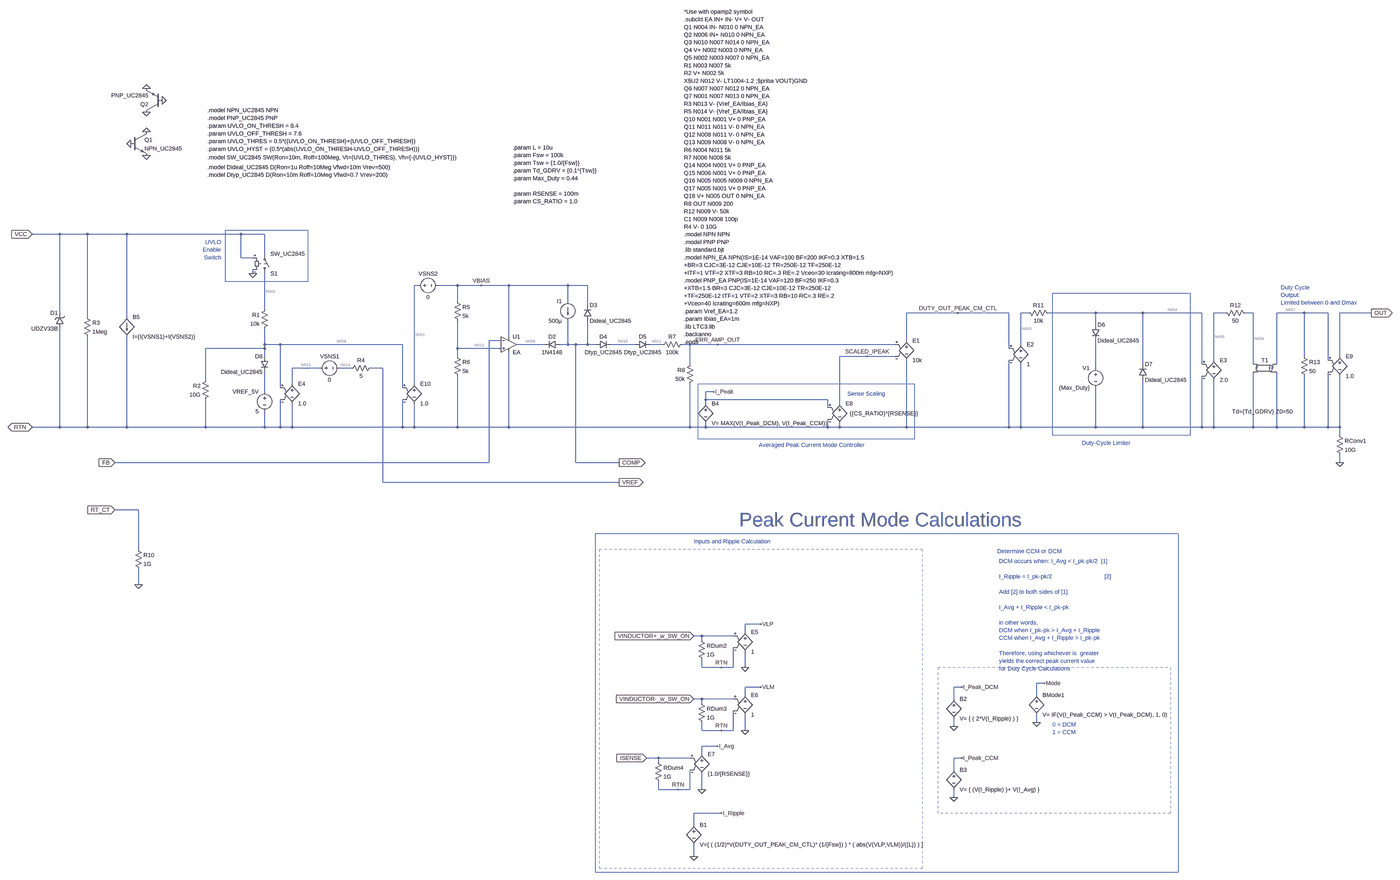
[diagram p0: schematic UC3845_AVG.asc, whole sheet]
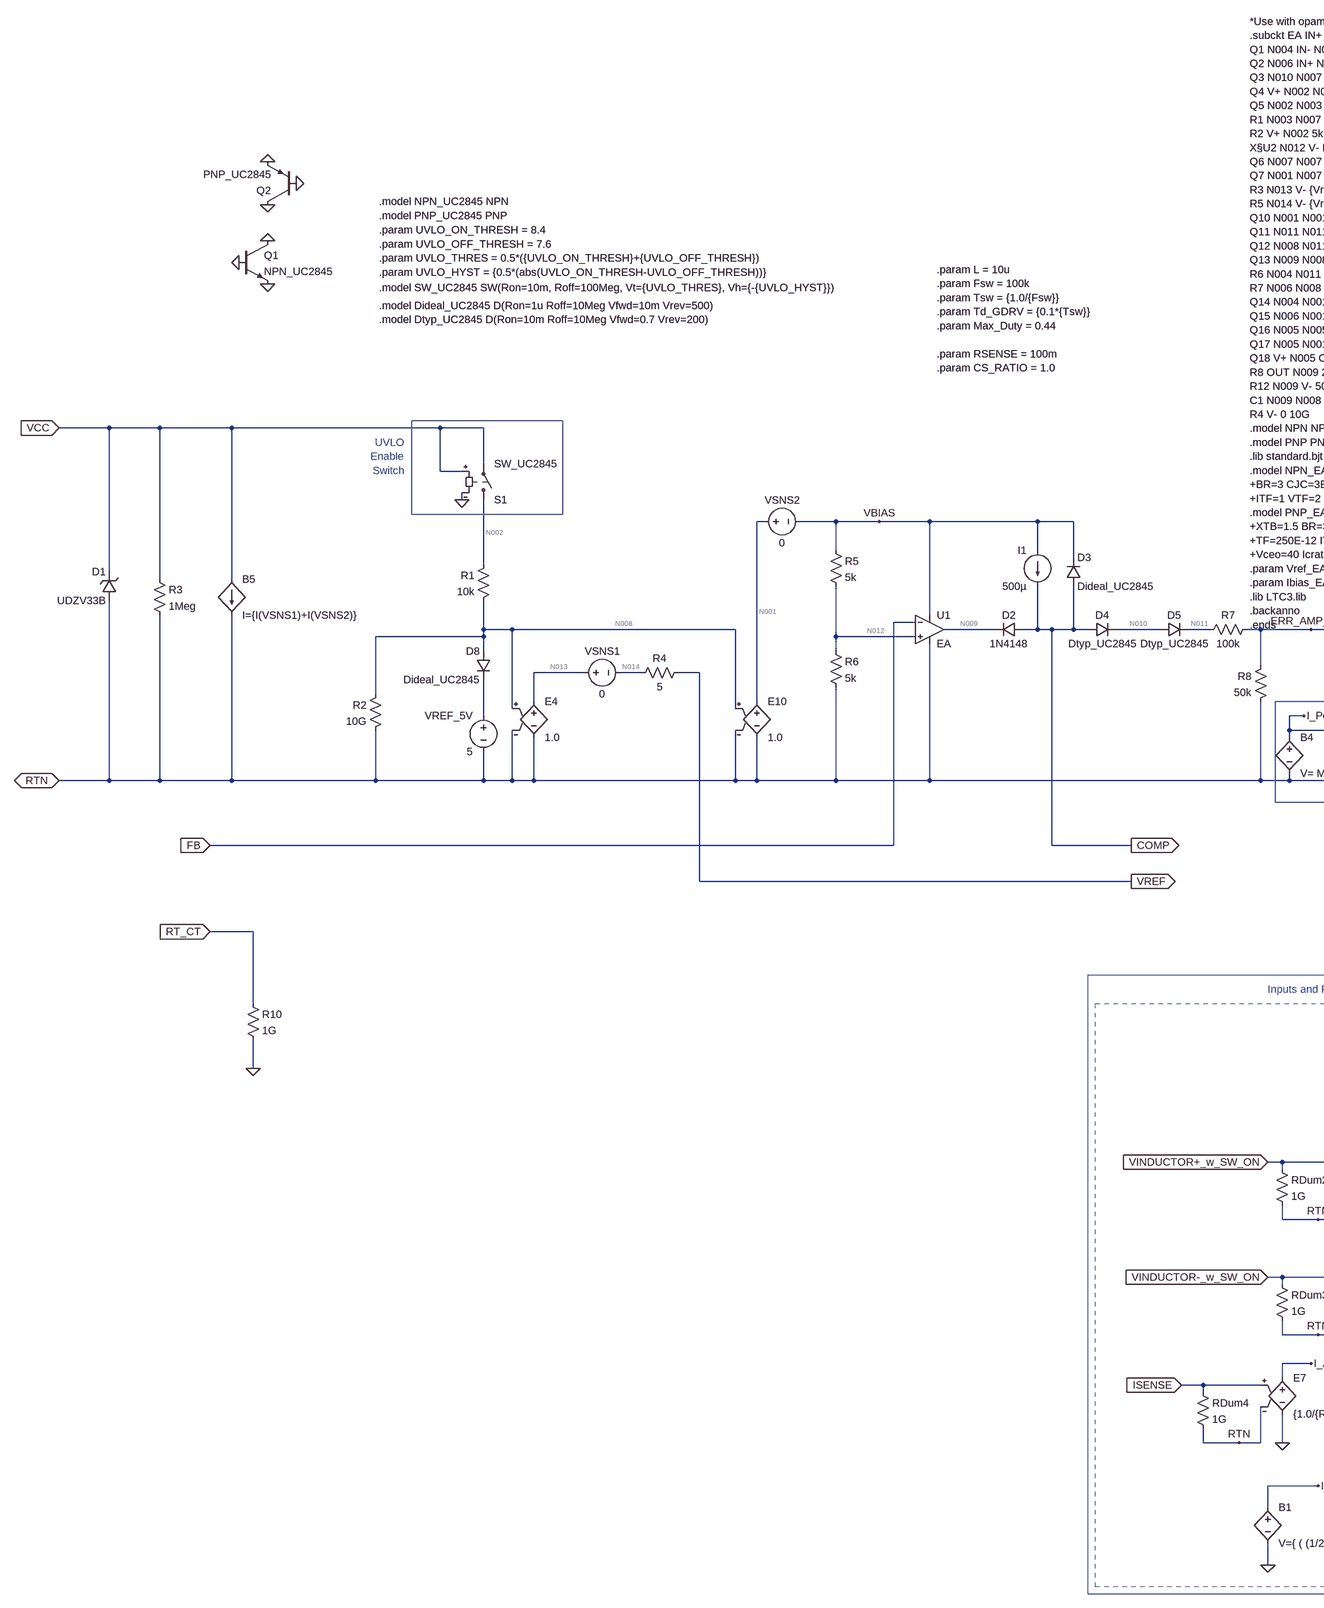
[diagram p1: schematic UC3845_AVG.asc, part, row 1 of 1, column 1 of 2]
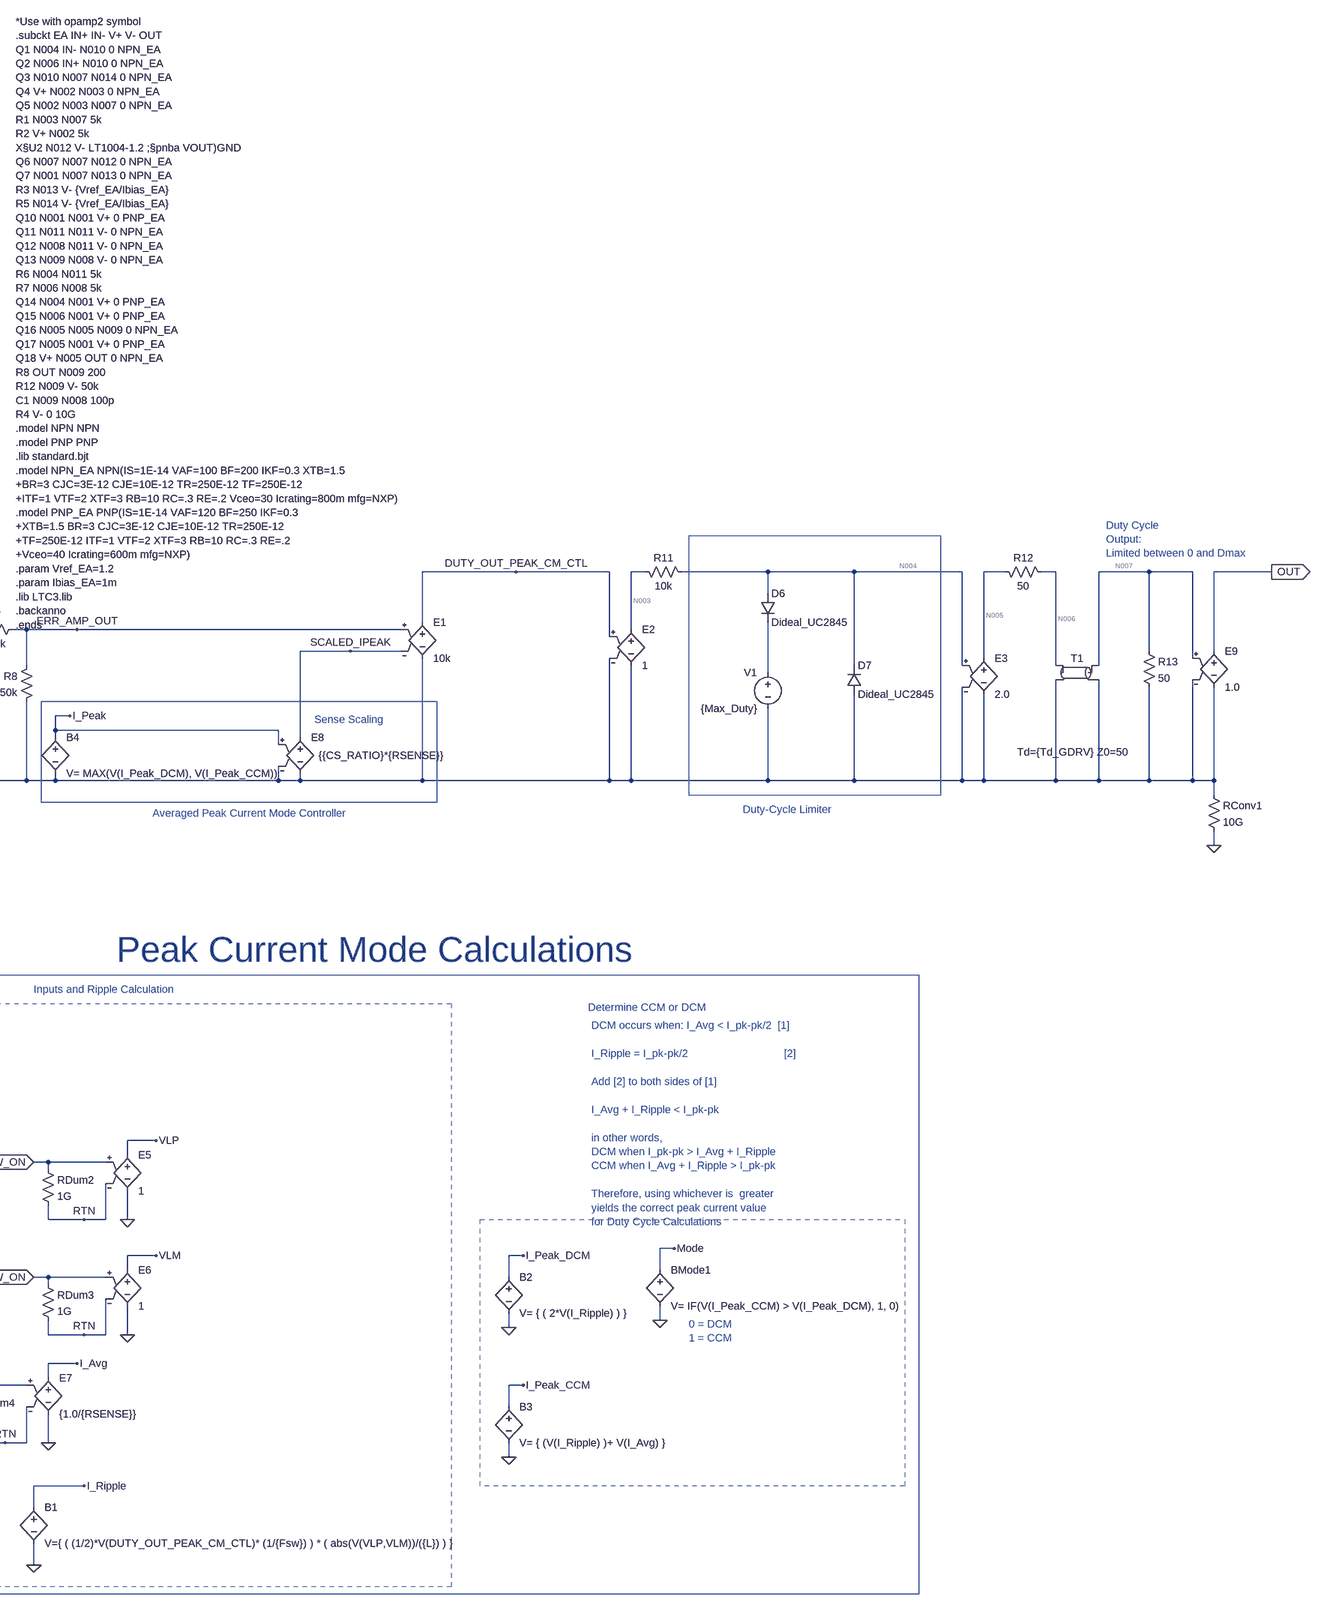
[diagram p2: schematic UC3845_AVG.asc, part, row 1 of 1, column 2 of 2]
UC3845_AVG.asc, the LTspice schematic file:
Version 4.1
SHEET 1 5444 3284
WIRE -736 -48 -848 -48
WIRE -624 -48 -736 -48
WIRE -464 -48 -624 -48
WIRE 0 -48 -464 -48
WIRE 96 -48 0 -48
WIRE 96 32 96 -48
WIRE 0 48 0 -48
WIRE 48 48 0 48
WIRE 48 112 48 96
WIRE 720 160 704 160
WIRE 880 160 800 160
WIRE 976 160 880 160
WIRE 1088 160 976 160
WIRE 1328 160 1088 160
WIRE 1408 160 1328 160
WIRE 880 224 880 160
WIRE 1328 224 1328 160
WIRE 1408 240 1408 160
WIRE 96 256 96 112
WIRE -736 272 -736 -48
WIRE 2912 272 2704 272
WIRE 3120 272 2912 272
WIRE 3200 272 3168 272
WIRE 3472 272 3280 272
WIRE 3664 272 3472 272
WIRE 3904 272 3664 272
WIRE 4000 272 3952 272
WIRE 4112 272 4080 272
WIRE 4320 272 4208 272
WIRE 4416 272 4320 272
WIRE 4592 272 4464 272
WIRE -624 288 -624 -48
WIRE -464 288 -464 -48
WIRE 3472 320 3472 272
WIRE 1088 368 1088 160
WIRE 1056 384 1008 384
WIRE 2704 384 2704 272
WIRE 96 400 96 336
WIRE 160 400 96 400
WIRE 656 400 160 400
WIRE 1232 400 1120 400
WIRE 1328 400 1328 304
WIRE 1328 400 1296 400
WIRE 1360 400 1328 400
WIRE 1408 400 1408 304
WIRE 1408 400 1360 400
WIRE 1440 400 1408 400
WIRE 1600 400 1504 400
WIRE 1712 400 1664 400
WIRE 1824 400 1792 400
WIRE 1936 400 1824 400
WIRE 2656 400 1936 400
WIRE 3168 400 3168 272
WIRE 96 416 96 400
WIRE 96 416 -144 416
WIRE 880 416 880 304
WIRE 1056 416 880 416
WIRE 3120 416 3120 272
WIRE 96 448 96 416
WIRE 880 448 880 416
WIRE 2544 448 2432 448
WIRE 2656 448 2544 448
WIRE 4320 448 4320 272
WIRE 4464 448 4464 272
WIRE 3952 464 3952 272
WIRE 4416 464 4416 272
WIRE 1824 480 1824 400
WIRE 3664 480 3664 272
WIRE 3904 480 3904 272
WIRE 4112 480 4112 272
WIRE 4208 480 4208 272
WIRE 320 496 208 496
WIRE 448 496 400 496
WIRE 576 496 528 496
WIRE 3472 496 3472 384
WIRE -144 544 -144 416
WIRE 208 560 208 496
WIRE 704 560 704 160
WIRE 160 576 160 400
WIRE 656 576 656 400
WIRE 96 592 96 512
WIRE 1920 592 1888 592
WIRE 1888 624 1888 592
WIRE 2384 624 1888 624
WIRE 1888 640 1888 624
WIRE 2432 640 2432 448
WIRE 2384 656 2384 624
WIRE -736 736 -736 336
WIRE -736 736 -848 736
WIRE -624 736 -624 368
WIRE -624 736 -736 736
WIRE -464 736 -464 368
WIRE -464 736 -624 736
WIRE -144 736 -144 624
WIRE -144 736 -464 736
WIRE 96 736 96 672
WIRE 96 736 -144 736
WIRE 160 736 160 624
WIRE 160 736 96 736
WIRE 208 736 208 640
WIRE 208 736 160 736
WIRE 656 736 656 624
WIRE 656 736 208 736
WIRE 704 736 704 640
WIRE 704 736 656 736
WIRE 880 736 880 528
WIRE 880 736 704 736
WIRE 1088 736 1088 432
WIRE 1088 736 880 736
WIRE 1824 736 1824 560
WIRE 1824 736 1088 736
WIRE 1888 736 1888 720
WIRE 1888 736 1824 736
WIRE 2384 736 2384 704
WIRE 2384 736 1888 736
WIRE 2432 736 2432 720
WIRE 2432 736 2384 736
WIRE 2704 736 2704 464
WIRE 2704 736 2432 736
WIRE 3120 736 3120 464
WIRE 3120 736 2704 736
WIRE 3168 736 3168 480
WIRE 3168 736 3120 736
WIRE 3472 736 3472 576
WIRE 3472 736 3168 736
WIRE 3664 736 3664 544
WIRE 3664 736 3472 736
WIRE 3904 736 3904 528
WIRE 3904 736 3664 736
WIRE 3952 736 3952 544
WIRE 3952 736 3904 736
WIRE 4112 736 4112 512
WIRE 4112 736 3952 736
WIRE 4208 736 4208 512
WIRE 4208 736 4112 736
WIRE 4320 736 4320 528
WIRE 4320 736 4208 736
WIRE 4416 736 4416 512
WIRE 4416 736 4320 736
WIRE 4464 736 4464 528
WIRE 4464 736 4416 736
WIRE 4464 768 4464 736
WIRE 1008 880 1008 384
WIRE 1008 880 -512 880
WIRE 1360 880 1360 400
WIRE 1536 880 1360 880
WIRE 4464 880 4464 848
WIRE 576 960 576 496
WIRE 1536 960 576 960
WIRE -416 1072 -512 1072
WIRE -416 1232 -416 1072
WIRE -416 1376 -416 1312
WIRE 2112 1536 2048 1536
WIRE 2048 1568 2048 1536
WIRE 1872 1584 1840 1584
WIRE 2000 1584 1872 1584
WIRE 1872 1600 1872 1584
WIRE 1872 1712 1872 1680
WIRE 1952 1712 1872 1712
WIRE 2000 1712 2000 1632
WIRE 2000 1712 1952 1712
WIRE 2048 1712 2048 1648
WIRE 3264 1776 3232 1776
WIRE 2112 1792 2048 1792
WIRE 2928 1792 2896 1792
WIRE 2048 1824 2048 1792
WIRE 3232 1824 3232 1776
WIRE 1872 1840 1840 1840
WIRE 2000 1840 1872 1840
WIRE 2896 1840 2896 1792
WIRE 1872 1856 1872 1840
WIRE 3232 1936 3232 1904
WIRE 2896 1952 2896 1920
WIRE 1872 1968 1872 1936
WIRE 1952 1968 1872 1968
WIRE 2000 1968 2000 1888
WIRE 2000 1968 1952 1968
WIRE 2048 1968 2048 1904
WIRE 1936 2032 1872 2032
WIRE 1872 2064 1872 2032
WIRE 1696 2080 1648 2080
WIRE 1824 2080 1696 2080
WIRE 2928 2080 2896 2080
WIRE 1696 2096 1696 2080
WIRE 2896 2128 2896 2080
WIRE 1696 2208 1696 2176
WIRE 1776 2208 1696 2208
WIRE 1824 2208 1824 2128
WIRE 1824 2208 1776 2208
WIRE 1872 2208 1872 2144
WIRE 2896 2240 2896 2208
WIRE 1952 2304 1840 2304
WIRE 1840 2352 1840 2304
WIRE 1840 2480 1840 2432
FLAG 48 112 0
FLAG -448 -416 0
FLAG -384 -640 0
FLAG -320 -592 0
FLAG -384 -368 0
FLAG 976 160 VBIAS
FLAG 1936 400 ERR_AMP_OUT
FLAG -512 880 FB
IOPIN -512 880 In
FLAG 1536 880 COMP
IOPIN 1536 880 Out
FLAG 1536 960 VREF
IOPIN 1536 960 Out
FLAG -512 1072 RT_CT
IOPIN -512 1072 In
FLAG -416 1376 0
FLAG -848 736 RTN
IOPIN -848 736 BiDir
FLAG 4464 880 0
FLAG 1952 1712 RTN
FLAG 2048 1712 0
FLAG 2112 1536 VLP
FLAG 1840 1584 VINDUCTOR+_w_SW_ON
IOPIN 1840 1584 In
FLAG 1952 1968 RTN
FLAG 2048 1968 0
FLAG 2112 1792 VLM
FLAG 1840 1840 VINDUCTOR-_w_SW_ON
IOPIN 1840 1840 In
FLAG 1776 2208 RTN
FLAG 1872 2208 0
FLAG 1936 2032 I_Avg
FLAG 1648 2080 ISENSE
IOPIN 1648 2080 In
FLAG 1840 2480 0
FLAG 1952 2304 I_Ripple
FLAG 2896 1952 0
FLAG 2928 1792 I_Peak_DCM
FLAG 2896 2240 0
FLAG 2928 2080 I_Peak_CCM
FLAG 1920 592 I_Peak
FLAG 3232 1936 0
FLAG 3264 1776 Mode
FLAG 2544 448 SCALED_IPEAK
FLAG 2912 272 DUTY_OUT_PEAK_CM_CTL
FLAG 4592 272 OUT
IOPIN 4592 272 Out
FLAG -848 -48 VCC
IOPIN -848 -48 In
FLAG -384 -464 0
FLAG -384 -544 0
SYMBOL npn -448 -464 R0
SYMATTR InstName Q1
SYMATTR Value NPN_UC2845
SYMBOL pnp -320 -544 R180
SYMATTR InstName Q2
SYMATTR Value PNP_UC2845
SYMBOL sw 96 128 M180
SYMATTR InstName S1
SYMATTR Value SW_UC2845
SYMBOL zener -720 336 R180
WINDOW 0 24 64 Left 2
WINDOW 3 24 0 Left 2
SYMATTR InstName D1
SYMATTR Value UDZV33B
SYMBOL diode 1296 384 R90
WINDOW 0 0 32 VBottom 2
WINDOW 3 32 32 VTop 2
SYMATTR InstName D2
SYMATTR Value 1N4148
SYMBOL current 1328 224 M0
WINDOW 123 0 0 Left 0
WINDOW 39 0 0 Left 0
SYMATTR InstName I1
SYMATTR Value 500µ
SYMBOL diode 1392 304 M180
WINDOW 0 24 64 Left 2
WINDOW 3 24 0 Left 2
SYMATTR InstName D3
SYMATTR Value Dideal_UC2845
SYMBOL res 864 208 R0
SYMATTR InstName R5
SYMATTR Value 5k
SYMBOL res 864 432 R0
SYMATTR InstName R6
SYMATTR Value 5k
SYMBOL diode 1440 384 M90
WINDOW 0 0 32 VBottom 2
WINDOW 3 32 32 VTop 2
SYMATTR InstName D4
SYMATTR Value Dtyp_UC2845
SYMBOL diode 1600 384 M90
WINDOW 0 0 32 VBottom 2
WINDOW 3 32 32 VTop 2
SYMATTR InstName D5
SYMATTR Value Dtyp_UC2845
SYMBOL res 1696 416 R270
WINDOW 0 32 56 VTop 2
WINDOW 3 0 56 VBottom 2
SYMATTR InstName R7
SYMATTR Value 100k
SYMBOL res 1840 464 M0
SYMATTR InstName R8
SYMATTR Value 50k
SYMBOL res -432 1216 R0
SYMATTR InstName R10
SYMATTR Value 1G
SYMBOL e 2704 368 R0
SYMATTR InstName E1
SYMATTR Value 10k
SYMBOL diode 3456 320 R0
SYMATTR InstName D6
SYMATTR Value Dideal_UC2845
SYMBOL voltage 3472 480 M0
WINDOW 123 0 0 Left 0
WINDOW 39 0 0 Left 0
SYMATTR InstName V1
SYMATTR Value {Max_Duty}
SYMBOL diode 3648 544 M180
WINDOW 0 24 64 Left 2
WINDOW 3 24 0 Left 2
SYMATTR InstName D7
SYMATTR Value Dideal_UC2845
SYMBOL e 3168 384 R0
SYMATTR InstName E2
SYMATTR Value 1
SYMBOL res 3184 256 M90
WINDOW 0 0 56 VBottom 2
WINDOW 3 32 56 VTop 2
SYMATTR InstName R11
SYMATTR Value 10k
SYMBOL e 3952 448 R0
SYMATTR InstName E3
SYMATTR Value 2.0
SYMBOL res 4096 288 M270
WINDOW 0 32 56 VTop 2
WINDOW 3 0 56 VBottom 2
SYMATTR InstName R12
SYMATTR Value 50
SYMBOL tline 4160 496 M0
WINDOW 3 10 192 Bottom 2
SYMATTR Value Td={Td_GDRV} Z0=50
SYMATTR InstName T1
SYMBOL res 4304 432 R0
SYMATTR InstName R13
SYMATTR Value 50
SYMBOL res 4448 752 R0
SYMATTR InstName RConv1
SYMATTR Value 10G
SYMBOL e 2048 1552 R0
SYMATTR InstName E5
SYMATTR Value 1
SYMBOL res 1856 1584 R0
SYMATTR InstName RDum2
SYMATTR Value 1G
SYMBOL e 2048 1808 R0
SYMATTR InstName E6
SYMATTR Value 1
SYMBOL res 1856 1840 R0
SYMATTR InstName RDum3
SYMATTR Value 1G
SYMBOL e 1872 2048 R0
SYMATTR InstName E7
SYMATTR Value {1.0/{RSENSE}}
SYMBOL res 1680 2080 R0
SYMATTR InstName RDum4
SYMATTR Value 1G
SYMBOL bv 1840 2336 R0
SYMATTR InstName B1
SYMATTR Value V={ ( (1/2)*V(DUTY_OUT_PEAK_CM_CTL)* (1/{Fsw}) ) * ( abs(V(VLP,VLM))/({L}) ) }
SYMBOL bv 2896 1824 R0
SYMATTR InstName B2
SYMATTR Value V= { ( 2*V(I_Ripple) ) }
SYMBOL bv 2896 2112 R0
SYMATTR InstName B3
SYMATTR Value V= { (V(I_Ripple) )+ V(I_Avg) }
SYMBOL bv 1888 624 R0
SYMATTR InstName B4
SYMATTR Value V= MAX(V(I_Peak_DCM), V(I_Peak_CCM))
SYMBOL e 2432 624 R0
WINDOW 3 41 56 Left 2
SYMATTR Value {{CS_RATIO}*{RSENSE}}
SYMATTR InstName E8
SYMBOL bv 3232 1808 R0
SYMATTR InstName BMode1
SYMATTR Value V= IF(V(I_Peak_CCM) > V(I_Peak_DCM), 1, 0)
SYMBOL e 4464 432 R0
SYMATTR InstName E9
SYMATTR Value 1.0
SYMBOL res 112 240 M0
SYMATTR InstName R1
SYMATTR Value 10k
SYMBOL e 208 544 R0
SYMATTR InstName E4
SYMATTR Value 1.0
SYMBOL res -128 528 M0
SYMATTR InstName R2
SYMATTR Value 10G
SYMBOL res -640 272 R0
SYMATTR InstName R3
SYMATTR Value 1Meg
SYMBOL e 704 544 R0
SYMATTR InstName E10
SYMATTR Value 1.0
SYMBOL diode 112 448 M0
SYMATTR InstName D8
SYMATTR Value Dideal_UC2845
SYMBOL voltage 96 576 M0
WINDOW 123 0 0 Left 0
WINDOW 39 0 0 Left 0
SYMATTR InstName VREF_5V
SYMATTR Value 5
SYMBOL voltage 304 496 R270
WINDOW 0 32 56 VTop 2
WINDOW 3 -32 56 VBottom 2
WINDOW 123 0 0 Left 0
WINDOW 39 0 0 Left 0
SYMATTR InstName VSNS1
SYMATTR Value 0
SYMBOL voltage 704 160 R270
WINDOW 0 32 56 VTop 2
WINDOW 3 -32 56 VBottom 2
WINDOW 123 0 0 Left 0
WINDOW 39 0 0 Left 0
SYMATTR InstName VSNS2
SYMATTR Value 0
SYMBOL bi -464 288 R0
SYMATTR InstName B5
SYMATTR Value I={I(VSNS1)+I(VSNS2)}
SYMBOL res 432 512 R270
WINDOW 0 32 56 VTop 2
WINDOW 3 0 56 VBottom 2
SYMATTR InstName R4
SYMATTR Value 5
SYMBOL OpAmps\\opamp2 1088 336 R0
SYMATTR InstName U1
SYMATTR Value EA
TEXT -136 -552 Left 2 !.model NPN_UC2845 NPN
TEXT -136 -520 Left 2 !.model PNP_UC2845 PNP
TEXT -136 -360 Left 2 !.model SW_UC2845 SW(Ron=10m, Roff=100Meg, Vt={UVLO_THRES}, Vh={-{UVLO_HYST}})
TEXT -136 -488 Left 2 !.param UVLO_ON_THRESH = 8.4\n.param UVLO_OFF_THRESH = 7.6\n.param UVLO_THRES = 0.5*({UVLO_ON_THRESH}+{UVLO_OFF_THRESH})\n.param UVLO_HYST = {0.5*(abs(UVLO_ON_THRESH-UVLO_OFF_THRESH))}
TEXT -80 -16 Right 2 ;UVLO\nEnable\nSwitch
TEXT -136 -320 Left 2 !.model Dideal_UC2845 D(Ron=1u Roff=10Meg Vfwd=10m Vrev=500)\n.model Dtyp_UC2845 D(Ron=10m Roff=10Meg Vfwd=0.7 Vrev=200)
TEXT 3080 1280 Left 2 ;DCM occurs when: I_Avg < I_pk-pk/2  [1]\n \nI_Ripple = I_pk-pk/2                                [2]\n  \nAdd [2] to both sides of [1]\n \nI_Avg + I_Ripple < I_pk-pk\n \nin other words,\nDCM when I_pk-pk > I_Avg + I_Ripple\nCCM when I_Avg + I_Ripple > I_pk-pk\n \nTherefore, using whichever is  greater\nyields the correct peak current value\nfor Duty Cycle Calculations
TEXT 3072 1240 Left 2 ;Determine CCM or DCM
TEXT 1840 1200 Left 2 ;Inputs and Ripple Calculation
TEXT 2464 600 Left 2 ;Sense Scaling
TEXT 3392 1944 Right 2 ;0 = DCM\n1 = CCM
TEXT 1104 -400 Left 2 !.param L = 10u\n.param Fsw = 100k\n.param Tsw = {1.0/{Fsw}}\n.param Td_GDRV = {0.1*{Tsw}}\n.param Max_Duty = 0.44\n \n.param RSENSE = 100m\n.param CS_RATIO = 1.0
TEXT 2104 808 Left 2 ;Averaged Peak Current Mode Controller
TEXT 2024 1112 Left 6 ;Peak Current Mode Calculations
TEXT 3416 800 Left 2 ;Duty-Cycle Limiter
TEXT 4224 168 Left 2 ;Duty Cycle\nOutput:\nLimited between 0 and Dmax
TEXT 1800 -952 Left 2 !*Use with opamp2 symbol\n.subckt EA IN+ IN- V+ V- OUT\nQ1 N004 IN- N010 0 NPN_EA\nQ2 N006 IN+ N010 0 NPN_EA\nQ3 N010 N007 N014 0 NPN_EA\nQ4 V+ N002 N003 0 NPN_EA\nQ5 N002 N003 N007 0 NPN_EA\nR1 N003 N007 5k\nR2 V+ N002 5k\nX§U2 N012 V- LT1004-1.2 ;§pnba VOUT)GND\nQ6 N007 N007 N012 0 NPN_EA\nQ7 N001 N007 N013 0 NPN_EA\nR3 N013 V- {Vref_EA/Ibias_EA}\nR5 N014 V- {Vref_EA/Ibias_EA}\nQ10 N001 N001 V+ 0 PNP_EA\nQ11 N011 N011 V- 0 NPN_EA\nQ12 N008 N011 V- 0 NPN_EA\nQ13 N009 N008 V- 0 NPN_EA\nR6 N004 N011 5k\nR7 N006 N008 5k\nQ14 N004 N001 V+ 0 PNP_EA\nQ15 N006 N001 V+ 0 PNP_EA\nQ16 N005 N005 N009 0 NPN_EA\nQ17 N005 N001 V+ 0 PNP_EA\nQ18 V+ N005 OUT 0 NPN_EA\nR8 OUT N009 200\nR12 N009 V- 50k\nC1 N009 N008 100p\nR4 V- 0 10G\n.model NPN NPN\n.model PNP PNP\n.lib standard.bjt\n.model NPN_EA NPN(IS=1E-14 VAF=100 BF=200 IKF=0.3 XTB=1.5\n+BR=3 CJC=3E-12 CJE=10E-12 TR=250E-12 TF=250E-12\n+ITF=1 VTF=2 XTF=3 RB=10 RC=.3 RE=.2 Vceo=30 Icrating=800m mfg=NXP)\n.model PNP_EA PNP(IS=1E-14 VAF=120 BF=250 IKF=0.3\n+XTB=1.5 BR=3 CJC=3E-12 CJE=10E-12 TR=250E-12\n+TF=250E-12 ITF=1 VTF=2 XTF=3 RB=10 RC=.3 RE=.2\n+Vceo=40 Icrating=600m mfg=NXP)\n.param Vref_EA=1.2\n.param Ibias_EA=1m\n.lib LTC3.lib\n.backanno\n.ends
RECTANGLE Normal 272 144 -64 -64
RECTANGLE Normal 2768 2528 1456 1232 1
RECTANGLE Normal 3776 2304 2832 1712 1
RECTANGLE Normal 2736 784 1856 560
RECTANGLE Normal 3808 2544 1440 1168
RECTANGLE Normal 3856 768 3296 192

The netlist it stands for:
* UC3845_AVG.asc
Q1 0 0 0 0 NPN_UC2845
Q2 0 0 0 0 PNP_UC2845
S1 N002 VCC VCC 0 SW_UC2845
D1 RTN VCC UDZV33B
D2 COMP N009 1N4148
I1 VBIAS COMP 500µ
D3 COMP VBIAS Dideal_UC2845
R5 VBIAS N012 5k
R6 N012 RTN 5k
D4 COMP N010 Dtyp_UC2845
D5 N010 N011 Dtyp_UC2845
R7 N011 ERR_AMP_OUT 100k
R8 ERR_AMP_OUT RTN 50k
R10 RT_CT 0 1G
E1 DUTY_OUT_PEAK_CM_CTL RTN ERR_AMP_OUT SCALED_IPEAK 10k
D6 N004 N015 Dideal_UC2845
V1 N015 RTN {Max_Duty}
D7 RTN N004 Dideal_UC2845
E2 N003 RTN DUTY_OUT_PEAK_CM_CTL RTN 1
R11 N003 N004 10k
E3 N005 RTN N004 RTN 2.0
R12 N006 N005 50
T1 N007 RTN N006 RTN Td={Td_GDRV} Z0=50
R13 N007 RTN 50
RConv1 RTN 0 10G
E5 VLP 0 VINDUCTOR+_w_SW_ON RTN 1
RDum2 VINDUCTOR+_w_SW_ON RTN 1G
E6 VLM 0 VINDUCTOR-_w_SW_ON RTN 1
RDum3 VINDUCTOR-_w_SW_ON RTN 1G
E7 I_Avg 0 ISENSE RTN {1.0/{RSENSE}}
RDum4 ISENSE RTN 1G
B1 I_Ripple 0 V={ ( (1/2)*V(DUTY_OUT_PEAK_CM_CTL)* (1/{Fsw}) ) * ( abs(V(VLP,VLM))/({L}) ) }
B2 I_Peak_DCM 0 V= { ( 2*V(I_Ripple) ) }
B3 I_Peak_CCM 0 V= { (V(I_Ripple) )+ V(I_Avg) }
B4 I_Peak RTN V= MAX(V(I_Peak_DCM), V(I_Peak_CCM))
E8 SCALED_IPEAK RTN I_Peak RTN {{CS_RATIO}*{RSENSE}}
BMode1 Mode 0 V= IF(V(I_Peak_CCM) > V(I_Peak_DCM), 1, 0)
E9 OUT RTN N007 RTN 1.0
R1 N002 N008 10k
E4 N013 RTN N008 RTN 1.0
R2 N008 RTN 10G
R3 VCC RTN 1Meg
E10 N001 RTN N008 RTN 1.0
D8 N008 N016 Dideal_UC2845
VREF_5V N016 RTN 5
VSNS1 N013 N014 0
VSNS2 N001 VBIAS 0
B5 VCC RTN I={I(VSNS1)+I(VSNS2)}
R4 N014 VREF 5
X§U1 N012 FB VBIAS RTN N009 EA  ; pins In+ In- V+ V- OUT
.model D D
.lib standard.dio
.model NPN NPN
.model PNP PNP
.lib standard.bjt
.model NPN_UC2845 NPN
.model PNP_UC2845 PNP
.model SW_UC2845 SW(Ron=10m, Roff=100Meg, Vt={UVLO_THRES}, Vh={-{UVLO_HYST}})
.param UVLO_ON_THRESH = 8.4
.param UVLO_OFF_THRESH = 7.6
.param UVLO_THRES = 0.5*({UVLO_ON_THRESH}+{UVLO_OFF_THRESH})
.param UVLO_HYST = {0.5*(abs(UVLO_ON_THRESH-UVLO_OFF_THRESH))}
* UVLO
* Enable
* Switch
.model Dideal_UC2845 D(Ron=1u Roff=10Meg Vfwd=10m Vrev=500)
.model Dtyp_UC2845 D(Ron=10m Roff=10Meg Vfwd=0.7 Vrev=200)
* DCM occurs when: I_Avg < I_pk-pk/2  [1]
* I_Ripple = I_pk-pk/2                                [2]
* Add [2] to both sides of [1]
* I_Avg + I_Ripple < I_pk-pk
* in other words,
* DCM when I_pk-pk > I_Avg + I_Ripple
* CCM when I_Avg + I_Ripple > I_pk-pk
* Therefore, using whichever is  greater
* yields the correct peak current value
* for Duty Cycle Calculations
* Determine CCM or DCM
* Inputs and Ripple Calculation
* Sense Scaling
* 0 = DCM
* 1 = CCM
.param L = 10u
.param Fsw = 100k
.param Tsw = {1.0/{Fsw}}
.param Td_GDRV = {0.1*{Tsw}}
.param Max_Duty = 0.44
.param RSENSE = 100m
.param CS_RATIO = 1.0
* Averaged Peak Current Mode Controller
* Peak Current Mode Calculations
* Duty-Cycle Limiter
* Duty Cycle
* Output:
* Limited between 0 and Dmax
*Use with opamp2 symbol
.subckt EA IN+ IN- V+ V- OUT
Q1 N004 IN- N010 0 NPN_EA
Q2 N006 IN+ N010 0 NPN_EA
Q3 N010 N007 N014 0 NPN_EA
Q4 V+ N002 N003 0 NPN_EA
Q5 N002 N003 N007 0 NPN_EA
R1 N003 N007 5k
R2 V+ N002 5k
X§U2 N012 V- LT1004-1.2 ;§pnba VOUT)GND
Q6 N007 N007 N012 0 NPN_EA
Q7 N001 N007 N013 0 NPN_EA
R3 N013 V- {Vref_EA/Ibias_EA}
R5 N014 V- {Vref_EA/Ibias_EA}
Q10 N001 N001 V+ 0 PNP_EA
Q11 N011 N011 V- 0 NPN_EA
Q12 N008 N011 V- 0 NPN_EA
Q13 N009 N008 V- 0 NPN_EA
R6 N004 N011 5k
R7 N006 N008 5k
Q14 N004 N001 V+ 0 PNP_EA
Q15 N006 N001 V+ 0 PNP_EA
Q16 N005 N005 N009 0 NPN_EA
Q17 N005 N001 V+ 0 PNP_EA
Q18 V+ N005 OUT 0 NPN_EA
R8 OUT N009 200
R12 N009 V- 50k
C1 N009 N008 100p
R4 V- 0 10G
.model NPN NPN
.model PNP PNP
.lib standard.bjt
.model NPN_EA NPN(IS=1E-14 VAF=100 BF=200 IKF=0.3 XTB=1.5
+BR=3 CJC=3E-12 CJE=10E-12 TR=250E-12 TF=250E-12
+ITF=1 VTF=2 XTF=3 RB=10 RC=.3 RE=.2 Vceo=30 Icrating=800m mfg=NXP)
.model PNP_EA PNP(IS=1E-14 VAF=120 BF=250 IKF=0.3
+XTB=1.5 BR=3 CJC=3E-12 CJE=10E-12 TR=250E-12
+TF=250E-12 ITF=1 VTF=2 XTF=3 RB=10 RC=.3 RE=.2
+Vceo=40 Icrating=600m mfg=NXP)
.param Vref_EA=1.2
.param Ibias_EA=1m
.lib LTC3.lib
.backanno
.ends
.backanno
.end